# EAGLE design RH042.2 (EAGLE 7.1.0)
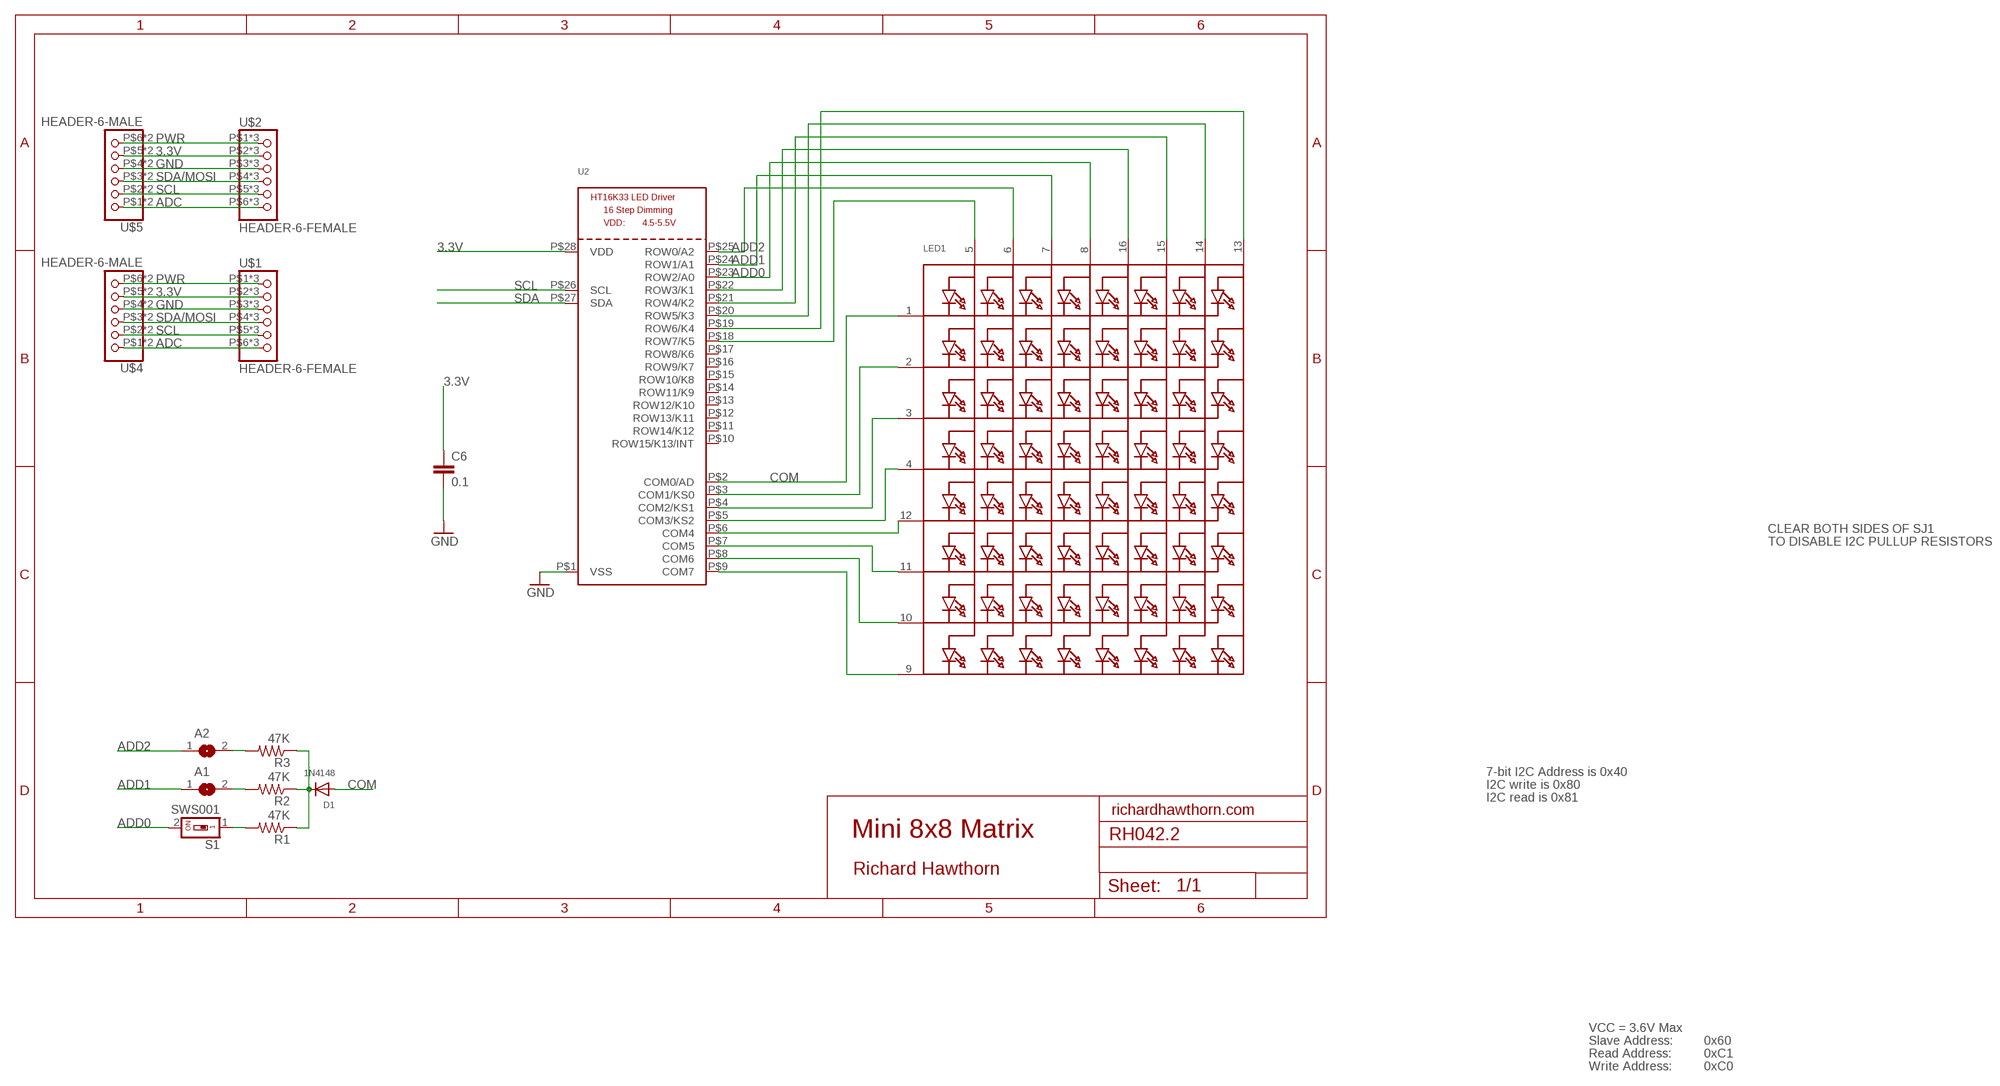
[diagram p0: schematic, sheet 1]

## Parts
A1  SJ  [SJ]
A2  SJ  [SJ]
C6  0.1  CAP0603-CAP  [0603-CAP]
D1  1N4148  DIODESOD-323F  [SOD-323F]
LED1  SEGMENT_8X8_ROWCATHODE  [SEGMENT_BL-M07C881UR]
R1  47K  R-US_R0805  [R0805]
R2  47K  R-US_R0805  [R0805]
R3  47K  R-US_R0805  [R0805]
S1  SWS001  [SMS-001]
U2  HT16K33_SOP28  [SOP28_300MIL]
U$1  HEADER-6-FEMALE  [2MMHEADER6]
U$2  HEADER-6-FEMALE  [2MMHEADER6]
U$4  HEADER-6-MALE  [2MMHEADERPIN6]
U$5  HEADER-6-MALE  [2MMHEADERPIN6]

## Nets
3.3V: C6.1 U2.P$28(VDD) U$1.P$2 U$1.P$10 U$1.P$18 U$2.P$2 U$2.P$10 U$2.P$18 U$4.P$5 U$4.P$13 U$5.P$5 U$5.P$13
ADC: U$1.P$6 U$1.P$14 U$1.P$22 U$2.P$6 U$2.P$14 U$2.P$22 U$4.P$1 U$4.P$9 U$5.P$1 U$5.P$9
ADD0: LED1.8(A4) S1.2 U2.P$23(ROW2/A0)
ADD1: A1.1 LED1.7(A3) U2.P$24(ROW1/A1)
ADD2: A2.1 LED1.6(A2) U2.P$25(ROW0/A2)
COM: D1.A LED1.1(K1) U2.P$2(COM0/AD)
GND [power]: C6.2 U2.P$1(VSS) U$1.P$3 U$1.P$11 U$1.P$19 U$2.P$3 U$2.P$11 U$2.P$19 U$4.P$4 U$4.P$12 U$5.P$4 U$5.P$12
N$4: LED1.9(K8) U2.P$9(COM7)
N$5: A2.2 R3.2
N$6: LED1.10(K7) U2.P$8(COM6)
N$14: LED1.11(K6) U2.P$7(COM5)
N$17: D1.C R1.1 R2.1 R3.1
N$18: R1.2 S1.1
N$19: A1.2 R2.2
N$22: LED1.12(K5) U2.P$6(COM4)
N$23: LED1.4(K4) U2.P$5(COM3/KS2)
N$24: LED1.3(K3) U2.P$4(COM2/KS1)
N$25: LED1.2(K2) U2.P$3(COM1/KS0)
N$27: LED1.16(A5) U2.P$22(ROW3/K1)
N$28: LED1.15(A6) U2.P$21(ROW4/K2)
N$29: LED1.5(A1) U2.P$18(ROW7/K5)
PWR [power]: U$1.P$1 U$1.P$9 U$1.P$17 U$2.P$1 U$2.P$9 U$2.P$17 U$4.P$6 U$4.P$14 U$5.P$6 U$5.P$14
SCL: U2.P$26(SCL) U$1.P$5 U$1.P$13 U$1.P$21 U$2.P$5 U$2.P$13 U$2.P$21 U$4.P$2 U$4.P$10 U$5.P$2 U$5.P$10
SDA: U2.P$27(SDA)
SDA/MOSI: U$1.P$4 U$1.P$12 U$1.P$20 U$2.P$4 U$2.P$12 U$2.P$20 U$4.P$3 U$4.P$11 U$5.P$3 U$5.P$11
SEG_F: LED1.14(A7) U2.P$20(ROW5/K3)
SEG_G: LED1.13(A8) U2.P$19(ROW6/K4)
Unconnected: U2.P$10(ROW15/K13/INT) U2.P$11(ROW14/K12) U2.P$12(ROW13/K11) U2.P$13(ROW12/K10) U2.P$14(ROW11/K9) U2.P$15(ROW10/K8) U2.P$16(ROW9/K7) U2.P$17(ROW8/K6)

## Notes on the sheet
- CLEAR BOTH SIDES OF SJ1
- TO DISABLE I2C PULLUP RESISTORS
- 7-bit I2C Address is 0x40
- I2C write is 0x80
- I2C read is 0x81
- richardhawthorn.com
- Mini 8x8 Matrix
- Richard Hawthorn
- VCC = 3.6V Max
- Slave Address: | 0x60
- Read Address: | 0xC1
- Write Address: | 0xC0

## Library data of the parts
A1 A2 = jumper:SJ: SMD solder JUMPER
C6 = LowPowerLab:CAP: Capacitor Standard 0603 ceramic capacitor, and 0.1" leaded capacitor.
D1 = adafruit:DIODE: Diode SMADIODE - SMA Surface Mount Package 20V 1A Schottky Diode Digikey: 641-1014-6-ND DO-1N4148 - Through Hole Small Current Diode SOD-123 20V 1 A (.5mV Vf) Schottky Diode - Digikey: MBRX120TPMSCT-ND SOD-323 10V 570mA (.38mV Vf, 3ns) Schottky Diode - Digikey: ZLLS410CT-ND SOD-523 30V 30mA Schottky Diode (RB751S-40TE61) - Digikey: RB751S-40TE61CT-ND SOT23-R/W - SOT23 Package (R = Solder Paste/Reflow Ovens, W = Hand-Soldering) BAT54Film 40V 300mA - Digikey: 497-7162-1-ND
LED1 = Richards:SEGMENT_8X8_ROWCATHODE: 8x8 LED Segment Displays: Row = Cathode 0.7" Red 8X8 Matrix, 1.9mm Round LEDs - BL-M07C881UR 1.2" Red 8x8 Matrix, 3.0mm Round LEDs - BL-M12A881UR 1.2" Red 8x8 Matrix, 3.0mm Square LEDs - BL-M12A883
R1-R3 = adafruit:R-US_: RESISTOR, American symbol
S1 = smd-special:SWS001: SMD Dip Switch 1 pol.
U2 = microbuilder:HT16K33_SOP28
U$1 U$2 = Richards:HEADER-6-FEMALE
U$4 U$5 = Richards:HEADER-6-MALE

## Net classes
1 power: width 0.381 mm, clearance 0.254 mm

## Board
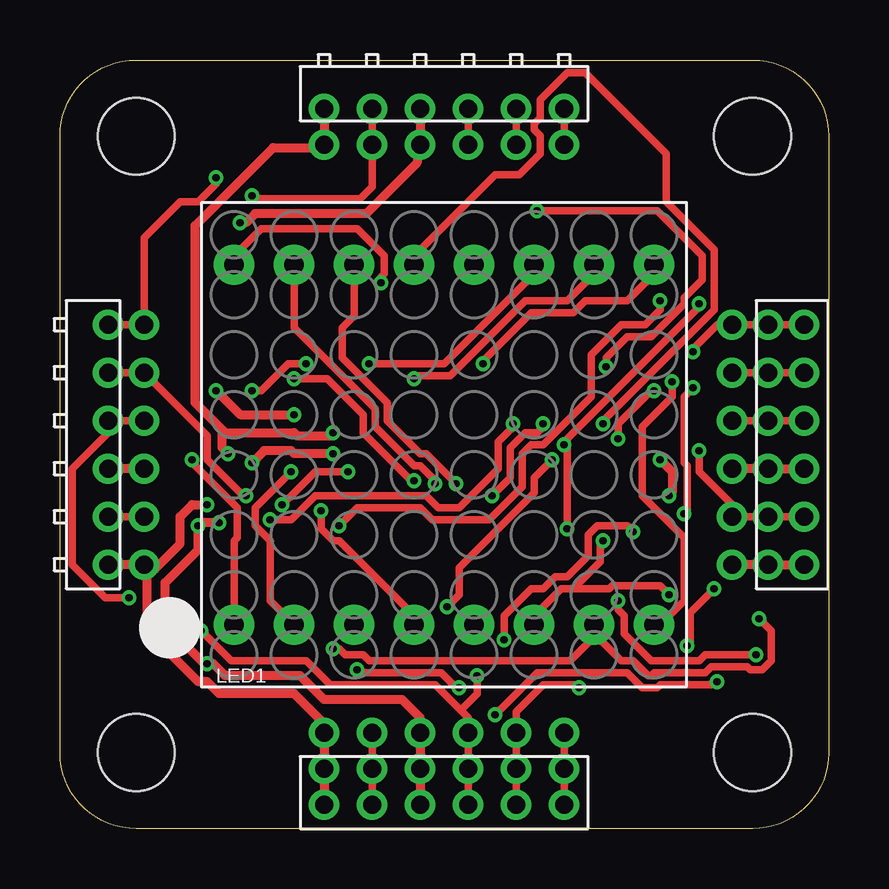
[diagram p1: board, top side]
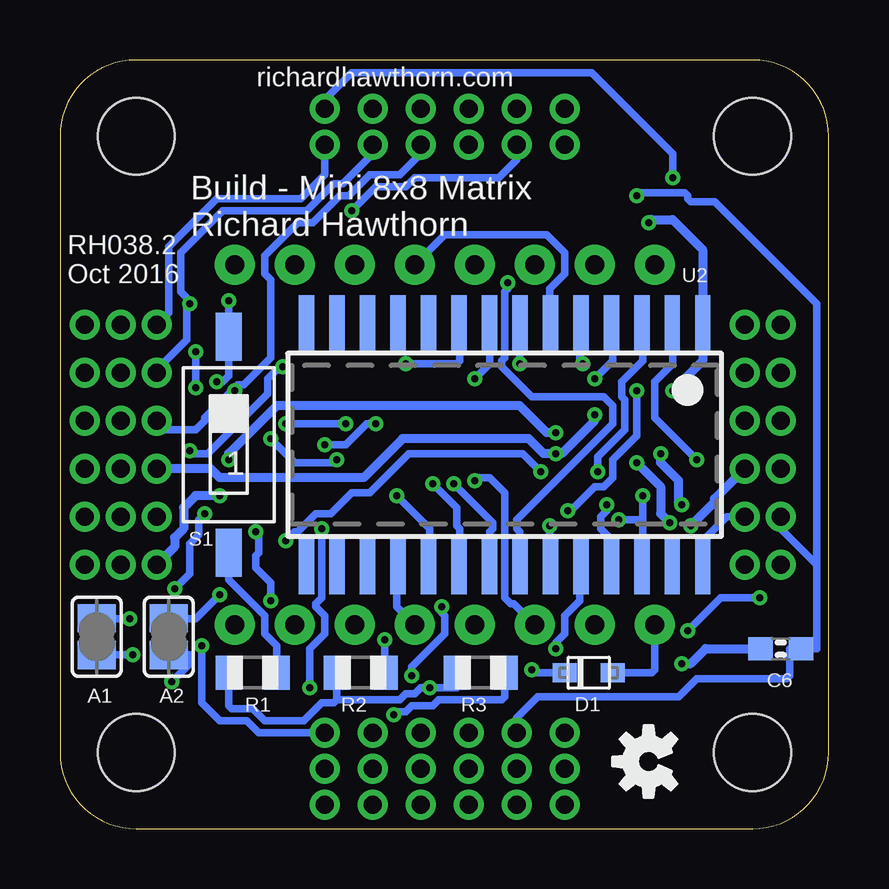
[diagram p2: board, bottom side, seen from below]

Size 32.03 x 32.03 mm. Coordinates in mm from the lower left corner, seen from the top.
Outline: 0,3.17 0,28.86 arc-90 3.17,32.03 28.86,32.03 arc-90 32.03,28.86 32.03,3.17 arc-90 28.86,0 3.17,0 arc-90 0,3.17
Copper layers (1*16): Top 0.035mm / dielectric 1.5mm / Bottom 0.035mm
Design rules "ITEADstudio_DRC *": minimum track width 12mil, minimum drill 12mil, track to track 6mil, track to pad 6mil, pad to pad 6mil, via to via 6mil, smd to smd 0mil, copper to edge 10mil, drill to drill 10mil, minimum pad ring 10mil, minimum via ring 6mil, stop-mask expansion 2mil, vias tented up to drill 100mil, thermal gap 15mil
Holes 3.2 mm at 3.17,3.17 28.86,3.17 3.17,28.86 28.86,28.86
tRestrict: area 0,0 to 5.7,5.7; area 26.3,0 to 32,5.7; area 26.3,26.3 to 32,32; area 0,26.3 to 5.7,32
bRestrict: area 0,26.3 to 5.7,32; area 26.3,26.3 to 32,32; area 26.3,0 to 32,5.7; area 0,0 to 5.7,5.7

### Footprints (pad centres in the part's own frame; a part is rotated, then mirrored left to right if it is on the bottom)
SJ = smd 1.168 x 1.6: 1 -0.762,0; 2 0.762,0
0603-CAP = smd 1.016 x 0.965: 1 -0.85,0; 2 0.85,0
SOD-323F = smd 1 x 0.8: A -1,0; C 1,0
SEGMENT_BL-M07C881UR = drill 0.8 pad 1.676: 1 -8.75,-7.5; 2 -6.25,-7.5; 3 -3.75,-7.5; 4 -1.25,-7.5; 5 1.25,-7.5; 6 3.75,-7.5; 7 6.25,-7.5; 8 8.75,-7.5; 9 8.75,7.5; 10 6.25,7.5; 11 3.75,7.5; 12 1.25,7.5; 13 -1.25,7.5; 14 -3.75,7.5; 15 -6.25,7.5; 16 -8.75,7.5
R0805 = smd 1.1 x 1.4: 1 -1,0; 2 1,0
SMS-001 = smd 1.092 x 2.007: 1 0,-4.496; 2 0,4.496
SOP28_300MIL = smd 0.635 x 2.286: P$1 -8.255,-5.08; P$2 -6.985,-5.08; P$3 -5.715,-5.08; P$4 -4.445,-5.08; P$5 -3.175,-5.08; P$6 -1.905,-5.08; P$7 -0.635,-5.08; P$8 0.635,-5.08; P$9 1.905,-5.08; P$10 3.175,-5.08; P$11 4.445,-5.08; P$12 5.715,-5.08; P$13 6.985,-5.08; P$14 8.255,-5.08; P$15 8.255,5.08; P$16 6.985,5.08; P$17 5.715,5.08; P$18 4.445,5.08; P$19 3.175,5.08; P$20 1.905,5.08; P$21 0.635,5.08; P$22 -0.635,5.08; P$23 -1.905,5.08; P$24 -3.175,5.08; P$25 -4.445,5.08; P$26 -5.715,5.08; P$27 -6.985,5.08; P$28 -8.255,5.08
2MMHEADER6 = drill 0.75: P$1 1,5; P$2 1,3; P$3 1,1; P$4 1,-1; P$5 1,-3; P$6 1,-5; P$9 -0.5,5; P$10 -0.5,3; P$11 -0.5,1; P$12 -0.5,-1; P$13 -0.5,-3; P$14 -0.5,-5; P$17 -2,5; P$18 -2,3; P$19 -2,1; P$20 -2,-1; P$21 -2,-3; P$22 -2,-5
2MMHEADERPIN6 = drill 0.75: P$1 1,5; P$2 1,3; P$3 1,1; P$4 1,-1; P$5 1,-3; P$6 1,-5; P$9 -0.5,5; P$10 -0.5,3; P$11 -0.5,1; P$12 -0.5,-1; P$13 -0.5,-3; P$14 -0.5,-5

### Placement (x,y rotation side)
A1  30.5,8 270 bottom
A2  27.5,8 270 bottom
C6  2,7.5 180 bottom
D1  10,6.5 180 bottom
LED1  16,16 0 top
R1  24,6.5 0 bottom
R2  19.5,6.5 0 bottom
R3  14.5,6.5 0 bottom
S1  25,16 0 bottom
U2  13.5,16 180 bottom
U$1  29,16 180 top
U$2  16,3 90 top
U$3  [OSHW-LOGO-S]  7.5,2.8 90 bottom
U$4  2.5,16 0 top
U$5  16,29.5 270 top

### Tracks (layer width: path | path; a pad name or v marks a point on that pad's centre or on a via)
3.3V  (via drill 0.3)
  Top 0.305: U$1.P$18 U$1.P$10 U$1.P$2 28,13.5 26.62,14.88 v26.62,15.75 | U$2.P$18 U$2.P$10 U$2.P$2 | U$5.P$13 U$5.P$5 13,26.75 12.5,26.25 8.12,26.25 v8,26.38 | U$4.P$13 U$4.P$5 | v22.75,19.25 22.75,19.62 23.62,20.5 24.62,20.5 26,21.88 26,22.12 26.75,22.88 26.75,23.88 24.88,25.75 v19.88,25.75
  Bottom 0.305: 0.5,11 0.5,7.5 C6.1 1.62,7.5 1.62,6.38 1.75,6.25 5.5,6.25 6.25,5.5 12.12,5.5 13,4.62 U$2.P$2 | 0.5,11 2,12.5 U$4.P$13 | U$4.P$5 4.25,13 5.25,12 5.25,11 U2.P$28 | v8,26.38 7.88,26.5 6,26.5 5.88,26.38 5.88,26.25 5.75,26.12 4.75,26.12 0.5,21.88 0.5,11 | v26.62,15.75 26.5,15.62 25.88,15.62 23.38,18.12 23.38,18.75 22.88,19.25 v22.75,19.25 | v19.88,25.75 18.88,26.75 17.62,26.75 17.25,27.12 13.75,27.12 13,27.88 U$5.P$5
ADC  (via drill 0.3)
  Top 0.305: U$4.P$9 U$4.P$1 3.5,24.62 5,26.12 5.75,26.12 6.5,26.88 v6.5,27.12 | U$5.P$9 U$5.P$1 | U$2.P$22 U$2.P$14 U$2.P$6 | U$1.P$22 U$1.P$14 U$1.P$6 27.38,21 26.38,20 v26.38,19.88 | v26.12,7.62 26.25,7.75 26.25,9 v27.25,10 | v26,13.12 26.12,13.25 26.12,15.12 26,15.25 26,18 v26.38,18.38
  Bottom 0.305: v6.5,27.12 6.5,28.12 9.88,31.5 19.88,31.5 21,30.38 U$5.P$9 | U$2.P$6 23.75,4 24.25,4.5 25.38,4.5 26.12,5.25 v26.12,7.62 | v27.25,10 26.62,10.62 26.62,11.88 26.25,12.25 26.25,12.88 v26,13.12 | v26.38,19.88 v26.38,18.38 | U$5.P$1 21,27.25 22,26.25 25.5,26.25 27.5,24.25 27.5,21.5 U$1.P$6
ADD0  (via drill 0.3)
  Top 0.305: LED1.8 25,8.5 26,9.5 26,12.12 24.25,13.88 24.25,16.75 25.5,18 v25.5,18.62 | v11.62,12.62 12.38,13.38 15,13.38 15.5,12.88 17.88,12.88 19.25,14.25 19.25,15.62 19.62,16 20.12,16 22.12,18 22.12,19.75 23.38,21 24.38,21 25,21.62 v25,22
  Bottom 0.305: v25.5,18.62 25.25,18.62 25,18.88 S1.2 v25,22 | v11.62,12.62 11.62,11 U2.P$23
ADD1  (via drill 0.3)
  Top 0.305: v29.12,8.75 29.62,8.25 29.62,7 29.25,6.62 28.75,6.62 28.62,6.75 27.12,6.75 26.88,6.5 24.75,6.5 24.62,6.38 24.5,6.38 23.88,7 23.38,7 22.25,8.12 LED1.7 22.25,8 21.25,7 12.88,7 12.62,7.25 11.88,7.25 11.62,7.5 v11.38,7.5
  Bottom 0.305: v29.12,8.75 A1.1 | v11.38,7.5 11.38,7.75 11,8.12 11,8.88 10.38,9.5 10.38,10.88 U2.P$24
ADD2  (via drill 0.3)
  Top 0.305: LED1.6 19.75,8.88 20.88,10 21.5,10 | 21.5,10 22.88,10 23,10.12 25,10.12 v25.38,9.75 | v9.25,13.5 10.62,14.88 v12,14.88 | v22.62,12 22.5,11.88 22.5,11.12 21.5,10.12 21.5,10
  Bottom 0.305: v25.38,9.75 26.38,8.75 A2.1 | v9.25,13.5 9.25,13.25 9.5,13 9.5,12.5 9,12 9,11 U2.P$25 | v12,14.88 12.75,15.62 17.5,15.62 19.12,14 19.88,14 20.75,13.12 21.38,13.12 22.12,12.38 22.25,12.38 v22.62,12
COM  (via drill 0.3)
  Top 0.305: v5.5,15.38 5.62,15.25 5.62,15.12 7.38,13.38 7.38,12.12 7.25,12 LED1.1
  Bottom 0.305: LED1.1 7.25,6.62 7.38,6.5 D1.A | v5.5,15.38 7.25,17.12 7.25,18.62 6.5,19.38 6.5,21 U2.P$2
GND  (via drill 0.3)
  Top 0.381: U$2.P$19 U$2.P$11 U$2.P$3 15,4.62 14.25,5.38 11,5.38 10,6.38 6.88,6.38 6.38,6.88 v6.12,6.88 6,6.88 4.38,8.5 4.38,10.25 5.75,11.62 v5.75,12.62 5.88,12.75 v6.62,12.75 | U$4.P$4 U$4.P$12 | U$1.P$3 U$1.P$11 U$1.P$19 | U$5.P$12 U$5.P$4 14.88,28.38 14.88,27.75 12.75,25.62 8.12,25.62 7.75,25.25 v7.5,25.25 | v9.75,17.25 7.5,17.25 v6.5,18.25 | v8,15.25 8.5,15.75 9.62,15.75 9.75,15.62 v11.38,15.62
  Bottom 0.381: C6.2 5.12,7.5 5.75,6.88 v6.12,6.88 | U$4.P$4 4.75,13.75 4.75,13.62 v5.75,12.62 | v7.5,25.25 7.38,25.38 6.5,25.38 5.25,24.12 5.25,21.12 U2.P$1 5.25,21 5.25,19.5 v6.5,18.25 | U$1.P$3 25.75,15 25.38,14.62 19.38,14.62 17.75,16.25 12.5,16.25 11.88,15.62 v11.38,15.62 11.12,15.62 9.75,17 v9.75,17.25 | v6.62,12.75 7,13.12 7,14.25 v8,15.25
N$4  (via drill 0.3)
  Top 0.305: LED1.9 24.75,23.12 23.62,22 21.88,22 21.38,21.5 19.62,21.5 17.62,19.5 v17.62,19.38
  Bottom 0.305: v17.62,19.38 15.5,19.38 15.38,19.5 15.38,21 U2.P$9
N$5  (via drill 0.3)
  Top 0.305: v27.38,6.12 27.25,6.12 27.12,6 25,6 24.88,5.88 24.25,5.88 23.62,6.5 19.88,6.5 v18.12,4.75
  Bottom 0.305: v27.38,6.12 26.62,6.88 26.62,7.25 A2.2 | v18.12,4.75 18,4.88 17.62,4.88 17.38,5.12 16.5,5.12 16.25,5.38 13.62,5.38 13.5,5.5 R3.2
N$6  (via drill 0.3)
  Top 0.305: LED1.10 22.25,23.12 21.12,22 19.38,22 16.25,18.88 14.88,18.88 v14.75,18.75
  Bottom 0.305: v14.75,18.75 14.12,19.38 14.12,21 U2.P$8
N$14  (via drill 0.3)
  Top 0.305: v12.88,19.38 16,19.38 19.75,23.12 LED1.11
  Bottom 0.305: v12.88,19.38 12.88,21 U2.P$7
N$17  (via drill 0.3)
  Top 0.305: v12.38,6.62 12.5,6.62 12.62,6.5 15.88,6.5 16.5,5.88 v16.62,5.88
  Bottom 0.305: D1.C 12.25,6.5 v12.38,6.62 | R3.1 15.5,5.88 v16.62,5.88 17,5.88 17.25,5.62 17.62,5.62 17.88,5.38 20.5,5.38 | R1.1 25,5.12 24.88,5 24,5 23.5,4.5 21.88,4.5 21.12,5.25 20.62,5.25 20.5,5.38 | R2.1 20.5,5.38
N$18
  Bottom 0.305: R1.2 23,7.62 23.5,8.12 23.5,8.88 25,10.38 S1.1
N$19  (via drill 0.3)
  Top 0.305: v18.5,7.88 18.5,8.88 19.62,10 20.12,10 20.62,10.5 21.12,10.5 22,11.38 22,12.25 22.38,12.62 23.62,12.62 v23.88,12.38 | v23.25,9.5 23.25,9.12 23.5,8.88 23.5,8.12 24.62,7 26.62,7 26.88,7.25 v29,7.25
  Bottom 0.305: v18.5,7.88 R2.2 | v23.88,12.38 23.75,12.25 23.75,11.5 23.88,11.38 23.88,10.88 23.25,10.25 v23.25,9.5 | v29,7.25 A1.2
N$22
  Bottom 0.305: LED1.12 16,24.75 11.75,24.75 11,24 11,23.12 11.62,22.5 11.62,21.12 U2.P$6
N$23  (via drill 0.3)
  Top 0.305: LED1.4 14.75,8.88 11.62,12 11.38,12 10.88,12.5 v10.88,13.25 | v8,18.25 8.38,18.25 9.5,19.38 v10.25,19.38
  Bottom 0.305: v10.88,13.25 10.75,13.25 9.75,14.25 9.38,14.25 9,14.62 9,15.38 8,16.38 v8,18.25 | v10.25,19.38 10.38,19.5 10.38,21 U2.P$5
N$24  (via drill 0.3)
  Top 0.305: v14.75,14.5 14.62,14.5 12.62,16.5 12.62,17.25 11.12,18.75 v9.75,18.75
  Bottom 0.305: LED1.3 13.12,9.38 13.25,9.38 13.5,9.62 13.5,14 14.12,14.62 14.62,14.62 v14.75,14.5 | v9.75,18.75 9,19.5 9,21 U2.P$4
N$25  (via drill 0.3)
  Top 0.305: LED1.2 8.75,9.5 8.75,12 8.12,12.62 8.12,13.38 v9.62,14.88
  Bottom 0.305: v9.62,14.88 9.62,15.5 8.5,16.62 8.5,17.88 8.62,18 8.62,18.62 7.75,19.5 7.75,21 U2.P$3
N$27  (via drill 0.3)
  Top 0.305: LED1.16 7.25,23.88 8.38,25 12.38,25 13.5,23.88 13.5,23.12 13.38,23 v13.38,22.75
  Bottom 0.305: v13.38,22.75 13.38,22.5 13.5,22.38 13.5,19.62 13.62,19.5 13.62,19.25 12.38,18 9.38,18 9,17.62 9,16.88 13,12.88 13,12.5 12.88,12.38 12.88,11 U2.P$22
N$28  (via drill 0.3)
  Top 0.305: LED1.15 9.75,20.88 13.12,17.5 13.12,16.75 14.75,15.12 15,15.12 15.62,14.5 v15.62,14.38
  Bottom 0.305: v15.62,14.38 14,12.75 14,12.5 14.12,12.38 14.12,11 U2.P$21
N$29
  Bottom 0.305: LED1.5 18,9.25 18,10.88 U2.P$18
PWR  (via drill 0.3)
  Top 0.381: U$1.P$1 U$1.P$9 U$1.P$17 | U$5.P$14 U$5.P$6 10.88,28.38 8.88,28.38 5.62,25.12 5.62,17.75 6.75,16.62 | U$4.P$6 U$4.P$14 | U$2.P$17 U$2.P$9 U$2.P$1 10.88,4.12 10.88,4.5 9.75,5.62 6.62,5.62 6.12,6.12 5.75,6.12 3.62,8.25 3.62,10.88 U$4.P$6 | 6.75,16.62 6.75,15.88 v7,15.62 | v6.12,13.5 5.5,13.5 5,13 5,11.88 3.75,10.62 U$4.P$6 | v25.38,13.88 25.5,14 25.5,14.88 v25,15.38 | v11.38,16.5 11.25,16.38 9.88,16.38 9.75,16.5 6.88,16.5 6.75,16.62
  Bottom 0.381: v7,15.62 7,15.25 6.25,14.5 6.25,13.62 v6.12,13.5 | U$1.P$1 27.25,11.75 27.25,12.12 26.88,12.5 26.88,13.38 26.38,13.88 v25.38,13.88 | v25,15.38 25,15.62 23,17.62 12.88,17.62 11.75,16.5 v11.38,16.5
SCL  (via drill 0.3)
  Top 0.305: v7.75,13.88 7.62,13.88 6.12,15.38 6.12,16.38 U$4.P$2 U$4.P$10 | U$2.P$21 U$2.P$13 U$2.P$5 19,4.88 20.12,6 21.5,6 v21.62,5.88 | U$5.P$10 U$5.P$2 | U$1.P$5 U$1.P$13 U$1.P$21 | 21.12,16 21.12,16.25 26.62,21.75 v26.62,21.88 | 21.12,16 v21.12,12.5 | v8.75,12.88 9.62,12.88 10.62,13.88 15.25,13.88 15.75,13.38 16.62,13.38 18.25,15 18.25,16.12 18.88,16.75 v18.88,16.88 | v21,16 21.12,16
  Bottom 0.305: v7.75,13.88 7.75,12.88 | 7.75,12.88 7.75,11 U2.P$26 | U$5.P$2 19,28.12 20.25,26.88 20.62,26.88 21.75,25.75 25.25,25.75 27,24 27,22.38 26.75,22.12 26.75,21.88 | 26.75,21.88 26.75,20.38 28,19.12 U$1.P$5 | v21.62,5.88 21.62,7.5 21,8.12 21,8.88 21.38,9.25 21.38,9.38 21.12,9.62 v21.12,12.5 | v26.62,21.88 26.75,21.88 | v8.75,12.88 7.75,12.88 | v18.88,16.88 19.25,16.88 20.12,16 v21,16
SDA/MOSI  (via drill 0.3)
  Top 0.305: U$5.P$11 U$5.P$3 | U$1.P$4 U$1.P$12 U$1.P$20 | U$4.P$3 U$4.P$11 2,16.5 0.5,15 0.5,11 1.88,9.62 v2.88,9.62 | U$2.P$20 U$2.P$12 U$2.P$4 17,4.62 16.69,4.94 | v5.88,8.25 7.12,7 10.25,7 11.25,6 15.62,6 16.69,4.94 | v24.75,18.25 24.62,18.25 23.25,16.88 v23.25,16.25 | v20.5,15.38 19.75,14.62 19.75,14 16.62,10.88 16.62,9.75 v16.12,9.25 | v17.38,6.38 17.38,5.62 16.69,4.94
  Bottom 0.305: U$5.P$3 17,28.12 17.88,27.25 19.12,27.25 20,26.38 20.38,26.38 21.5,25.25 22.12,25.25 23.5,23.88 23.5,23.12 23.25,22.88 23.25,19.62 24.38,18.5 24.62,18.5 24.81,18.31 | 24.81,18.31 26,17.12 26,17 26.38,16.62 27.62,16.62 U$1.P$4 | v2.88,9.62 4.5,9.62 v5.88,8.25 | v23.25,16.25 22.25,15.25 20.62,15.25 v20.5,15.38 | v16.12,9.25 16.12,9 16,8.88 16,8.12 17.38,6.75 v17.38,6.38 | v24.75,18.25 24.81,18.31
SEG_F  (via drill 0.3)
  Top 0.305: LED1.14 12.25,21.38 11.75,20.88 11.75,19.62 13.62,17.75 13.62,17 15,15.62 15.25,15.62 v16.5,14.38
  Bottom 0.305: v16.5,14.38 15.5,13.38 15.5,12.62 15.38,12.5 15.38,11 U2.P$20
SEG_G  (via drill 0.3)
  Top 0.305: LED1.13 14.75,23.88 18.12,27.25 19.12,27.25 20,28.12 20,28.88 19.75,29.12 19.75,29.38 20,29.62 20,30.38 21.12,31.5 21.88,31.5 25.25,28.12 25.25,26.12 27.25,24.12 27.25,21.62 22.62,17 v22.62,16.88 | v20.12,16.88 20.12,16.75 19.88,16.5 19.38,16.5 18.75,15.88 18.75,14.62 v18,13.88
  Bottom 0.305: v20.12,16.88 v22.62,16.88 | v18,13.88 16.62,12.5 16.62,11 U2.P$19

### Text on the board
bPlace: richardhawthorn.com | Build - Mini 8x8 Matrix / Richard Hawthorn | RH038.2 / Oct 2016
tDocu: REG